# EAGLE design can-weichendecoder-servo (EAGLE 7.5.0)
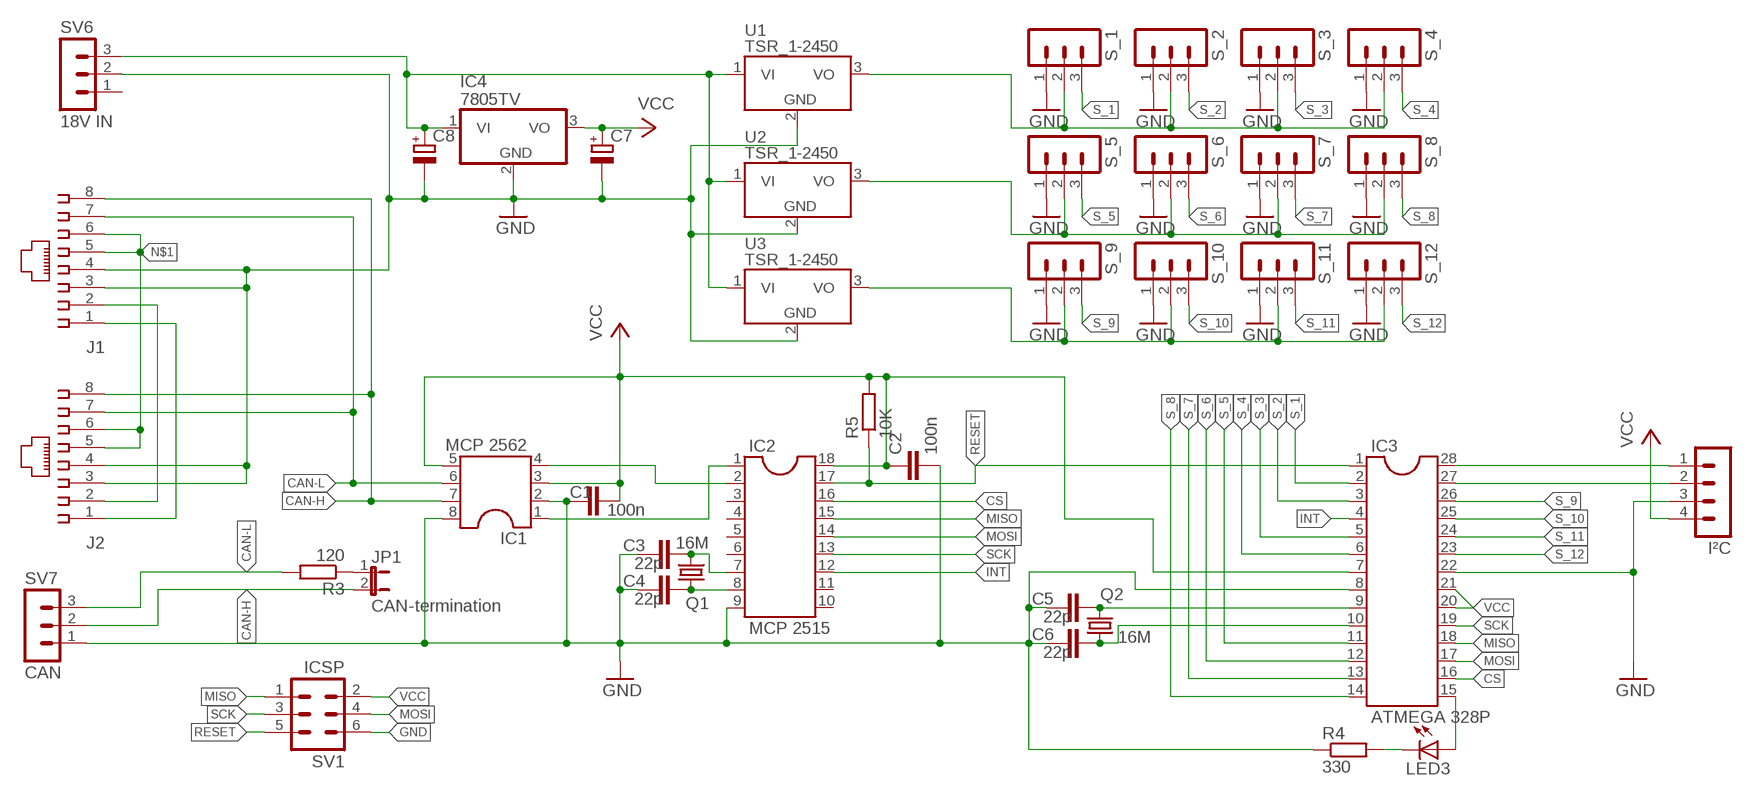
[diagram p0: schematic, sheet 1]

## Parts
C1  100n  C2.5/2  [C2.5-2]
C2  100n  C2.5/2  [C2.5-2]
C3  22p  C2.5/2  [C2.5-2]
C4  22p  C2.5/2  [C2.5-2]
C5  22p  C2.5/2  [C2.5-2]
C6  22p  C2.5/2  [C2.5-2]
C7  CPOL-EUE2.5-6  [E2,5-6]
C8  CPOL-EUE2.5-6  [E2,5-6]
IC1  MCP 2562  DIL8S  [SOCKET-08]
IC2  MCP 2515  DIL18S  [SOCKET-18]
IC3  ATMEGA 328P  DIL28-3  [DIL28-3]
IC4  7805TV  [TO220V]
I²C  MA04-1  [MA04-1]
J1  215877-7  [215877-7]
J2  215877-7  [215877-7]
JP1  CAN-termination  JP1E  [JP1]
LED3  LED5MM  [LED5MM]
Q1  16M  CRYSTALHC49S  [HC49/S]
Q2  16M  CRYSTALHC49S  [HC49/S]
R3  120  R-EU_0207/10  [0207/10]
R4  330  R-EU_0207/10  [0207/10]
R5  10K  R-EU_0207/10  [0207/10]
S_1  MA03-1  [MA03-1]
S_2  MA03-1  [MA03-1]
S_3  MA03-1  [MA03-1]
S_4  MA03-1  [MA03-1]
S_5  MA03-1  [MA03-1]
S_6  MA03-1  [MA03-1]
S_7  MA03-1  [MA03-1]
S_8  MA03-1  [MA03-1]
S_9  MA03-1  [MA03-1]
S_10  MA03-1  [MA03-1]
S_11  MA03-1  [MA03-1]
S_12  MA03-1  [MA03-1]
SV1  ICSP  MA03-2  [MA03-2]
SV6  18V IN  MA03-1  [MA03-1]
SV7  CAN  MA03-1  [MA03-1]
U1  TSR_1-2450  [TSR-1]
U2  TSR_1-2450  [TSR-1]
U3  TSR_1-2450  [TSR-1]

## Nets
CAN-H: IC1.7 J1.8 J2.8 JP1.2 SV7.2
CAN-L: IC1.6 J1.7 J2.7 R3.2 SV7.3
CS: IC2.16 IC3.16
GND: C1.1 C2.2 C3.1 C4.1 C5.1 C6.1 C7.- C8.- IC1.2 IC1.8 IC2.9 IC3.8 IC3.22 IC4.2(GND) I²C.3 J1.3 J1.4 J2.3 J2.4 R4.1 S_1.1 S_2.1 S_3.1 S_4.1 S_5.1 S_6.1 S_7.1 S_8.1 S_9.1 S_10.1 S_11.1 S_12.1 SV1.6 SV6.2 SV7.1 U1.2(GND) U2.2(GND) U3.2(GND)
INT: IC2.12 IC3.4
MISO: IC2.15 IC3.18 SV1.1
MOSI: IC2.14 IC3.17 SV1.4
N$1: J1.5 J1.6 J2.5 J2.6
N$2: IC1.4 IC2.2
N$3: J1.2 J2.2
N$4: C4.2 IC2.8 Q1.1
N$5: JP1.1 R3.1
N$6: C3.2 IC2.7 Q1.2
N$7: C5.2 IC3.9 Q2.2
N$8: C6.2 IC3.10 Q2.1
N$9: IC1.1 IC2.1
N$12: LED3.K(C) R4.2
N$13: IC3.15 LED3.A
N$24: S_1.2 S_2.2 S_3.2 S_4.2 U1.3(VO)
N$25: S_5.2 S_6.2 S_7.2 S_8.2 U2.3(VO)
N$26: S_9.2 S_10.2 S_11.2 S_12.2 U3.3(VO)
N$32: J1.1 J2.1
N$33: IC3.28 I²C.1
N$34: IC3.27 I²C.2
RESET: IC2.17 IC3.1 R5.1 SV1.5
S_1: IC3.2 S_1.3
S_2: IC3.3 S_2.3
S_3: IC3.5 S_3.3
S_4: IC3.6 S_4.3
S_5: IC3.11 S_5.3
S_6: IC3.12 S_6.3
S_7: IC3.13 S_7.3
S_8: IC3.14 S_8.3
S_9: IC3.26 S_9.3
S_10: IC3.25 S_10.3
S_11: IC3.24 S_11.3
S_12: IC3.23 S_12.3
SCK: IC2.13 IC3.19 SV1.3
VCC: C1.2 C2.1 C7.+ IC1.3 IC1.5 IC2.18 IC3.7 IC3.20 IC3.21 IC4.3(VO) I²C.4 R5.2 SV1.2
VI: C8.+ IC4.1(VI) SV6.3 U1.1(VI) U2.1(VI) U3.1(VI)
Unconnected: IC2.3 IC2.4 IC2.5 IC2.6 IC2.10 IC2.11 SV6.1

## Library data of the parts
C1-C6 = capacitor-wima:C: CAPACITOR naming: grid - package width
C7 C8 = resistor:CPOL-EU: POLARIZED CAPACITOR, European symbol
IC1 = ic-package:DIL8: Dual In Line / Socket
IC2 = ic-package:DIL18: Dual In Line / Socket
IC3 = ic-package:DIL28: Dual In Line
IC4 = linear:78*: Positive VOLTAGE REGULATOR Source: http://cache.national.com/ds/LM/LM78L05.pdf http://www.fairchildsemi.com/ds/LM/LM7805.pdf
I²C = con-lstb:MA04-1: PIN HEADER; OC_FARNELL: unknown; OC_NEWARK: unknown
J1 J2 = con-amp:215877-7: AMP connector
JP1 = jumper:JP1E: JUMPER
LED3 = led:LED: LED OSRAM: - CHIPLED LG R971, LG N971, LY N971, LG Q971, LY Q971, LO R971, LY R971 LH N974, LH R974 LS Q976, LO Q976, LY Q976 LO Q996 - Hyper CHIPLED LW Q18S LB Q993, LB Q99A, LB R99A - SideLED LS A670, LO A670, LY A670, LG A670, LP A670 LB A673, LV A673, LT A673, LW A673 LH A674 LY A675 LS A676, LA A676, LO A676, LY A676, LW A676 LS A679, LY A679, LG A679 - Hyper Micro SIDELED® LS Y876, LA Y876, LO Y876, LY Y876 LT Y87S - SmartLED LW L88C, LW L88S LB L89C, LB L89S, LG L890 LS L89K, LO L89K, LY L89K LS L896, LA L896, LO L896, LY L896 - TOPLED LS T670, LO T670, LY T670, LG T670, LP T670 LSG T670, LSP T670, LSY T670, LOP T670, LYG T670 LG T671, LOG T671, LSG T671 LB T673, LV T673, LT T673, LW T673 LH T674 LS T676, LA T676, LO T676, LY T676, LB T676, LH T676, LSB T676, LW T676 LB T67C, LV T67C, LT T67C, LS T67K, LO T67K, LY T67K, LW E67C LS E67B, LA E67B, LO E67B, LY E67B, LB E67C, LV E67C, LT E67C LW T67C LS T679, LY T679, LG T679 LS T770, LO T770, LY T770, LG T770, LP T770 LB T773, LV T773, LT T773, LW T773 LH T774 LS E675, LA E675, LY E675, LS T675 LS T776, LA T776, LO T776, LY T776, LB T776 LHGB T686 LT T68C, LB T68C - Hyper Mini TOPLED® LB M676 - Mini TOPLED Santana® LG M470 LS M47K, LO M47K, LY M47K Source: http://www.osram.convergy.de LUXEON: - LUMILED® LXK2-PW12-R00, LXK2-PW12-S00, LXK2-PW14-U00, LXK2-PW14-V00 LXK2-PM12-R00, LXK2-PM12-S00, LXK2-PM14-U00 LXK2-PE12-Q00, LXK2-PE12-R00, LXK2-PE12-S00, LXK2-PE14-T00, LXK2-PE14-U00 LXK2-PB12-K00, LXK2-PB12-L00, LXK2-PB12-M00, LXK2-PB14-N00, LXK2-PB14-P00, LXK2-PB14-Q00 LXK2-PR12-L00, LXK2-PR12-M00, LXK2-PR14-Q00, LXK2-PR14-R00 LXK2-PD12-Q00, LXK2-PD12-R00, LXK2-PD12-S00 LXK2-PH12-R00, LXK2-PH12-S00 LXK2-PL12-P00, LXK2-PL12-Q00, LXK2-PL12-R00 Source: www.luxeon.com KINGBRIGHT: KA-3528ASYC Source: www.kingbright.com
Q1 Q2 = crystal:CRYSTAL: CRYSTAL; OC_FARNELL: 1667008; OC_NEWARK: unknown
R3-R5 = rcl:R-EU_: RESISTOR, European symbol
S_1-S_12 SV6 SV7 = con-lstb:MA03-1: PIN HEADER; OC_FARNELL: unknown; OC_NEWARK: unknown
SV1 = con-lstb:MA03-2: PIN HEADER; OC_FARNELL: unknown; OC_NEWARK: unknown
U1-U3 = _traco_tsr-1:TSR_1-*: TRACO TSR-1 Series Point-of-Load DC/DC-Converters Vi max. 36 V; Vo = (1.2 .. 15)V ±2%; Io = 0 .. 1 A SIP-Package (drop-in replacement for 78xx linear voltage regulators in TO220-package, vertically assembled) Source: www.tracopower.com Technologies: TSR 1- Vi (V) Vo (V) ±2% Io = 0 .. 1 A 24_ ( generic ) 2412 4.6 .. 36 1.2 2415 4.6 .. 36 1.5 2418 4.6 .. 36 1.8 2425 4.6 .. 36 2.5 2433 4.75.. 36 3.3 2450 6.5 .. 36 5.0 2465 9.0 .. 36 6.5 2490 12 .. 36 9.0 24120 15 .. 36 12 24150 18 .. 36 15 Author: Dipl.-Ing. FH Rainer Bayer HHN Hochschule Heilbronn, rainer.bayer@hs-heilbronn.de Ingenieurbüro ing-rb, mail@ing-rb.de

## Board
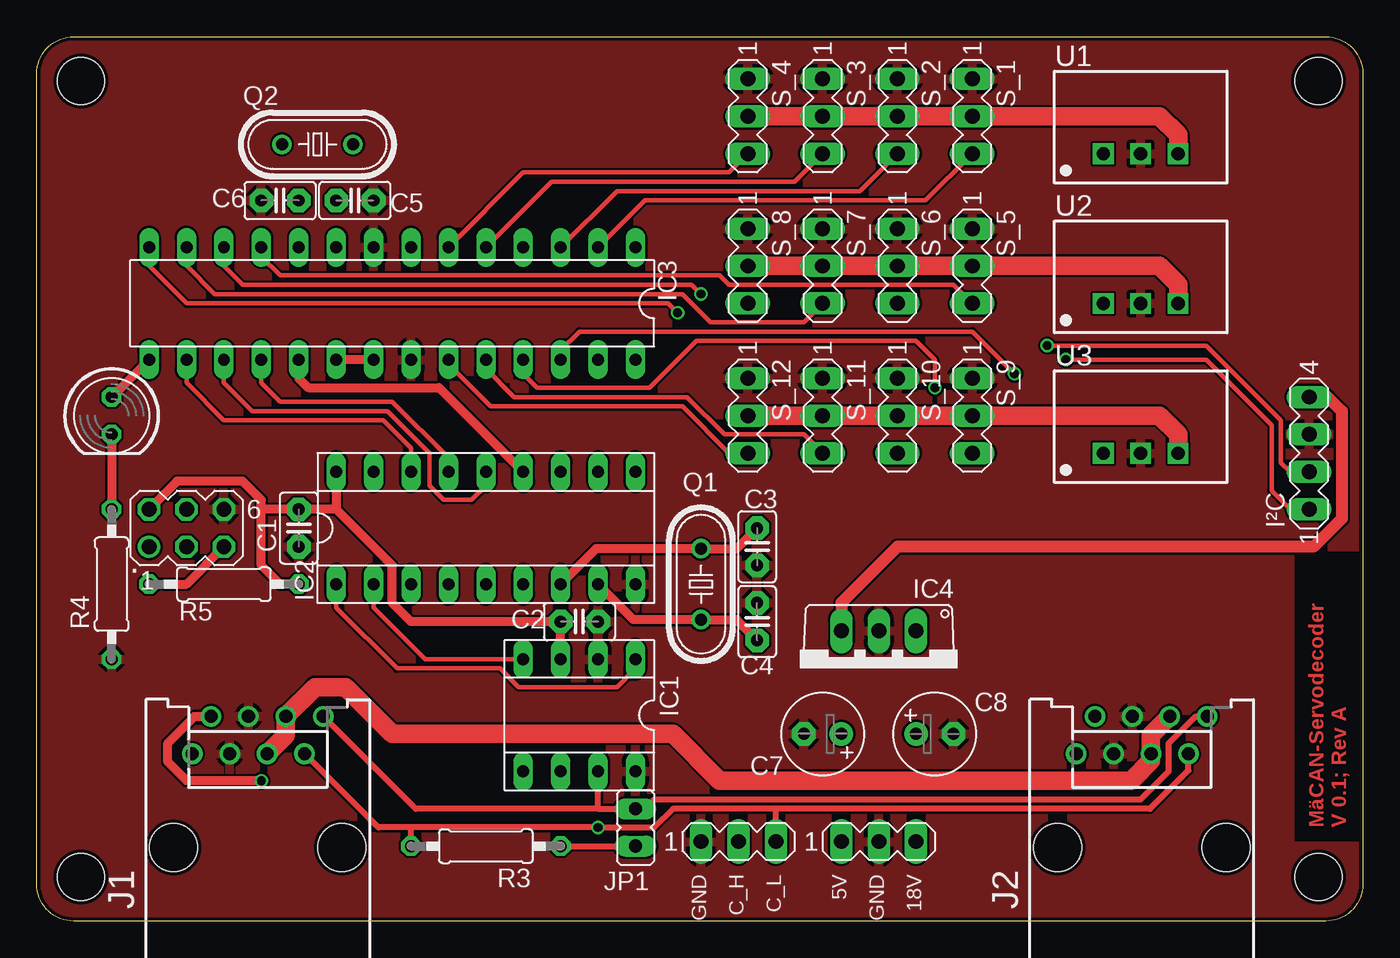
[diagram p1: board, top side]
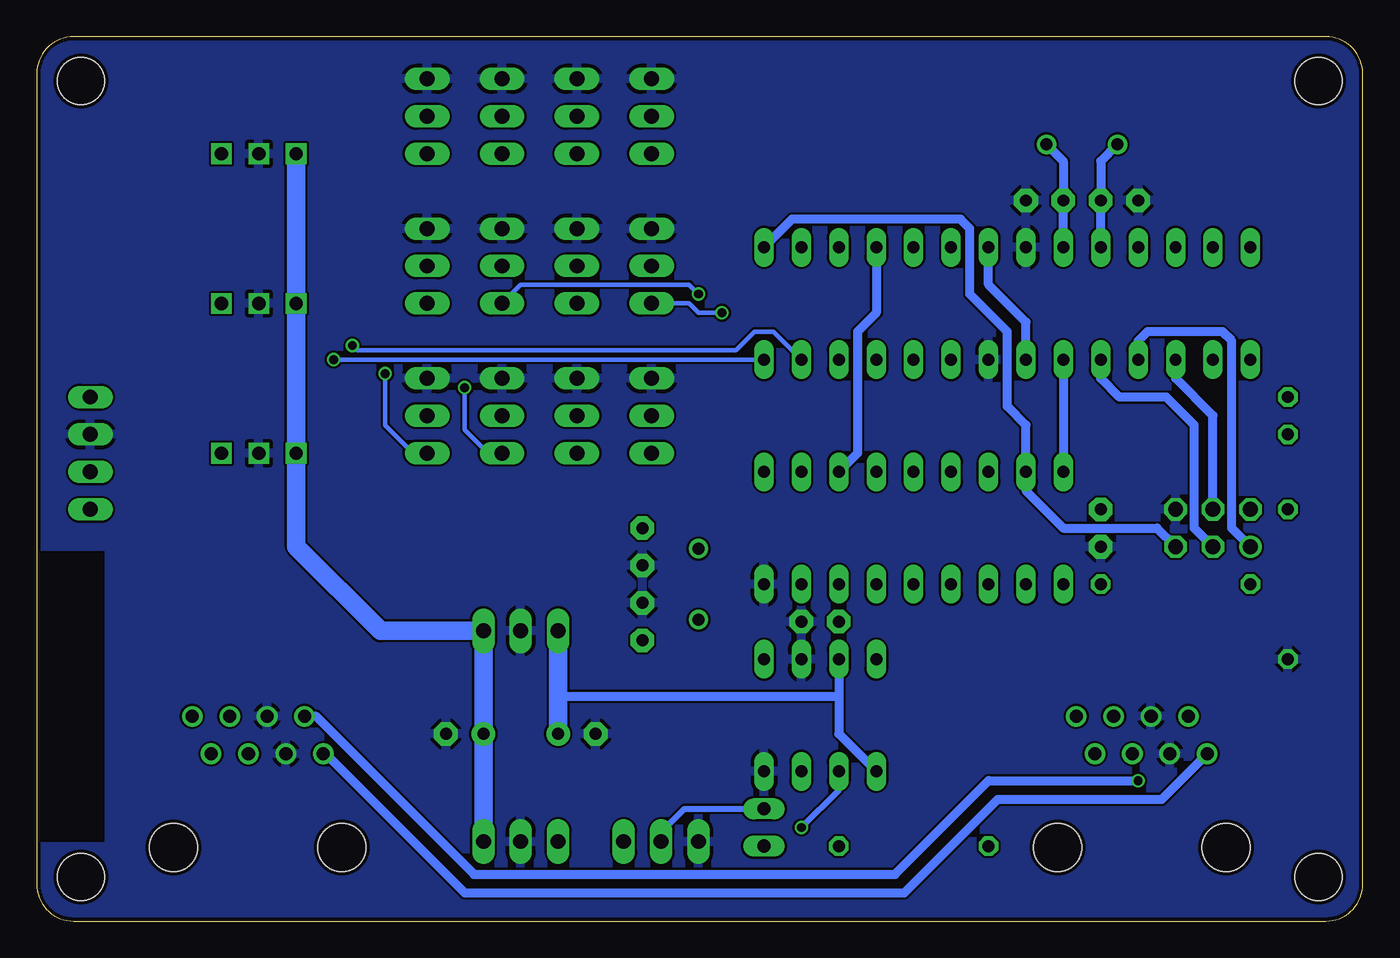
[diagram p2: board, bottom side, seen from below]

Size 90 x 60 mm. Coordinates in mm from the lower left corner, seen from the top.
Outline: 0,57.5 arc-90 2.5,60 87.5,60 arc-90 90,57.5 90,2.5 arc-90 87.5,0 2.5,0 arc-90 0,2.5 0,57.5
Copper layers (1*16): Top 0.035mm / dielectric 1.5mm / Bottom 0.035mm
Design rules "ITEADstudioDRC": minimum track width 6mil, minimum drill 12mil, track to track 6mil, track to pad 6mil, pad to pad 6mil, via to via 6mil, smd to smd 0mil, copper to edge 10mil, drill to drill 10mil, minimum pad ring 10mil, minimum via ring 6mil, stop-mask expansion 2mil, vias tented up to drill 100mil, thermal gap 10mil
Holes 3.2 mm at 3,3 87,3 87,57 3,57

### Footprints (pad centres in the part's own frame; a part is rotated, then mirrored left to right if it is on the bottom)
C2.5-2 = drill 0.813 pad 1.6 octagon: 1 -1.27,0; 2 1.27,0
E2,5-6 = drill 0.813 pad 1.6: + -1.27,0 | drill 0.813 pad 1.6 octagon: - 1.27,0
SOCKET-08 = drill 0.813 long: 1 -3.81,-3.81; 2 -1.27,-3.81; 3 1.27,-3.81; 4 3.81,-3.81; 5 3.81,3.81; 6 1.27,3.81; 7 -1.27,3.81; 8 -3.81,3.81
SOCKET-18 = drill 0.813 long: 1 -10.16,-3.81; 2 -7.62,-3.81; 3 -5.08,-3.81; 4 -2.54,-3.81; 5 0,-3.81; 6 2.54,-3.81; 7 5.08,-3.81; 8 7.62,-3.81; 9 10.16,-3.81; 10 10.16,3.81; 11 7.62,3.81; 12 5.08,3.81; 13 2.54,3.81; 14 0,3.81; 15 -2.54,3.81; 16 -5.08,3.81; 17 -7.62,3.81; 18 -10.16,3.81
DIL28-3 = drill 0.813 long: 1 -16.51,-3.81; 2 -13.97,-3.81; 3 -11.43,-3.81; 4 -8.89,-3.81; 5 -6.35,-3.81; 6 -3.81,-3.81; 7 -1.27,-3.81; 8 1.27,-3.81; 9 3.81,-3.81; 10 6.35,-3.81; 11 8.89,-3.81; 12 11.43,-3.81; 13 13.97,-3.81; 14 16.51,-3.81; 15 16.51,3.81; 16 13.97,3.81; 17 11.43,3.81; 18 8.89,3.81; 19 6.35,3.81; 20 3.81,3.81; 21 1.27,3.81; 22 -1.27,3.81; 23 -3.81,3.81; 24 -6.35,3.81; 25 -8.89,3.81; 26 -11.43,3.81; 27 -13.97,3.81; 28 -16.51,3.81
TO220V = drill 1.016 long: 1 -2.54,-2.54; 2 0,-2.54; 3 2.54,-2.54
MA04-1 = drill 1.016 long: 1 -3.81,0; 2 -1.27,0; 3 1.27,0; 4 3.81,0
215877-7 = drill 0.889: 1 -4.445,6.35; 2 -3.175,8.89; 3 -1.905,6.35; 4 -0.635,8.89; 5 0.635,6.35; 6 1.905,8.89; 7 3.175,6.35; 8 4.445,8.89 | hole 3.251: -5.715,0; 5.715,0
JP1 = drill 0.914 long: 1 0,-1.27; 2 0,1.27
LED5MM = drill 0.813 octagon: A -1.27,0; K 1.27,0
HC49/S = drill 0.813: 1 -2.413,0; 2 2.413,0
0207/10 = drill 0.813 octagon: 1 -5.08,0; 2 5.08,0
MA03-1 = drill 1.016 long: 1 -2.54,0; 2 0,0; 3 2.54,0
MA03-2 = drill 1.016: 1 -2.54,-1.27 | drill 1.016 octagon: 2 -2.54,1.27; 3 0,-1.27; 4 0,1.27; 5 2.54,-1.27; 6 2.54,1.27
TSR-1 = drill 0.9 square: 1 -2.54,0; 2 0,0; 3 2.54,0

### Placement (x,y rotation side)
C1  17.78,26.67 90 top
C2  36.83,20.32 0 top
C3  48.9,25.4 90 top
C4  48.9,20.32 270 top
C5  21.59,48.9 180 top
C6  16.51,48.9 0 top
C7  53.34,12.7 180 top
C8  60.96,12.7 0 top
IC1  36.83,13.97 180 top
IC2  30.48,26.67 0 top
IC3  24.13,41.91 180 top
IC4  57.15,17.14 180 top
I²C  86.36,31.75 90 top
J1  15,5 0 top
J2  75,5 0 top
JP1  40.64,6.35 0 top
LED3  5.08,34.29 270 top
Q1  45.09,22.86 90 top
Q2  19.05,52.7 0 top
R3  30.48,5.08 180 top
R4  5.08,22.86 90 top
R5  12.7,22.86 0 top
S_1  63.5,54.61 270 top
S_2  58.42,54.61 270 top
S_3  53.34,54.61 270 top
S_4  48.26,54.61 270 top
S_5  63.5,44.45 270 top
S_6  58.42,44.45 270 top
S_7  53.34,44.45 270 top
S_8  48.26,44.45 270 top
S_9  63.5,34.29 270 top
S_10  58.42,34.29 270 top
S_11  53.34,34.29 270 top
S_12  48.26,34.29 270 top
SV1  10.16,26.67 0 top
SV6  57.15,5.4 0 top
SV7  47.62,5.4 0 top
U1  74.93,52.07 0 top
U2  74.93,41.91 0 top
U3  74.93,31.75 0 top

### Tracks (layer width: path | path; a pad name or v marks a point on that pad's centre or on a via)
CAN-H
  Top 0.406: 38.1,7.62 IC1.7 | 38.1,7.62 JP1.2 41.27,7.62 41.91,8.26 74.93,8.26 76.83,10.16 76.83,12.06 78.66,13.89 J2.8 | 38.1,7.62 25.71,7.62 J1.8
  Bottom 0.406: SV7.2 47.62,6.03 46.04,7.62 JP1.2
CAN-L  (via drill 0.6)
  Top 0.406: 50.16,7.62 75.56,7.62 78.17,10.23 J2.7 | 50.16,7.62 43.18,7.62 41.91,6.35 v38.1,6.35 25.4,6.35 | SV7.3 50.16,7.62 | 25.4,6.35 23.18,6.35 J1.7 | R3.2 25.4,6.35
  Bottom 0.406: IC1.6 35.56,8.89 v38.1,6.35
CS
  Top 0.305: IC3.16 10.16,36.51 12.7,33.97 23.5,33.97 25.4,32.07 IC2.16
GND
  pour Top: -1.27,-1.27 91.44,-1.27 91.44,5.08 85.09,5.08 85.09,25.4 91.44,25.4 91.44,60.96 -1.27,60.96
  pour Bottom: -1.27,-1.27 91.44,-1.27 91.44,5.08 85.09,5.08 85.09,25.4 91.44,25.4 91.44,60.96 -1.27,60.96
INT
  Bottom 0.61: IC3.4 33.02,41.27 34.29,40.01 34.29,31.75 IC2.12
MISO
  Top 0.305: IC2.15 27.94,31.43 24.13,35.24 16.51,35.24 15.24,36.51 IC3.18
  Bottom 0.61: SV1.1 8.89,26.67 8.89,39.37 9.53,40.01 14.61,40.01 15.24,39.37 IC3.18
MOSI
  Top 0.305: IC2.14 30.48,29.53 29.53,28.57 27.62,28.57 26.67,29.53 26.67,31.75 23.81,34.61 14.61,34.61 12.7,36.51 IC3.17
  Bottom 0.61: SV1.4 10.16,34.29 12.7,36.83 IC3.17
N$1
  Top 1.27: J1.5 16.91,12.62 J1.6 18.89,15.88 20.95,15.88 24.13,12.7 43.18,12.7 46.35,9.53 74.3,9.53 75.64,10.87 J2.5 75.64,12.62 J2.6
N$2
  Top 0.305: IC1.4 26.35,17.78 22.86,21.27 IC2.2
N$3  (via drill 0.6)
  Top 0.61: v15.24,9.53 10.16,9.53 8.89,10.79 8.89,12.06 10.71,13.89 J1.2
  Bottom 0.61: v15.24,9.53 25.4,9.53 31.75,3.17 60.33,3.17 71.04,13.89 J2.2
N$4
  Top 0.61: IC2.8 40.51,20.45 Q1.1 47.5,20.45 C4.2
N$5
  Top 0.406: R3.1 JP1.1
N$6
  Top 0.61: IC2.7 37.97,25.27 Q1.2 47.5,25.27 C3.2
N$7
  Bottom 0.61: IC3.9 C5.2 20.32,51.56 Q2.2
N$8
  Bottom 0.61: IC3.10 C6.2 17.78,51.56 Q2.1
N$9
  Top 0.305: IC1.1 40.64,17.14 39.37,15.88 32.7,15.88 31.43,17.14 24.45,17.14 20.32,21.27 IC2.1
N$12
  Top 0.61: LED3.K R4.2
N$13
  Top 0.61: IC3.15 LED3.A
N$24
  Top 1.27: U1.3 77.47,53.34 76.2,54.61 S_1.2 S_2.2 S_3.2 S_4.2
N$25
  Top 1.27: U2.3 77.47,43.18 76.2,44.45 S_5.2 S_6.2 S_7.2 S_8.2
N$26
  Top 1.27: U3.3 77.47,33.02 76.2,34.29 S_9.2 S_10.2 S_11.2 S_12.2
N$32
  Bottom 0.61: J1.1 13.65,8.26 24.77,8.26 31.11,1.91 60.96,1.91 70.41,11.35 J2.1
N$33  (via drill 0.6)
  Top 0.305: v69.85,38.1 79.38,38.1 83.82,33.66 83.82,29.21 85.09,27.94 I²C.1
  Bottom 0.305: IC3.28 v69.85,38.1
N$34  (via drill 0.6)
  Top 0.305: I²C.2 85.09,30.48 84.45,31.11 84.45,33.97 79.38,39.05 v68.58,39.05
  Bottom 0.305: IC3.27 40.01,40.01 41.27,40.01 42.55,38.73 68.26,38.73 v68.58,39.05
RESET
  Top 0.61: R5.1 10.16,22.86 SV1.5
  Bottom 0.61: SV1.5 13.97,26.67 20.32,26.67 22.86,29.21 IC2.17 22.86,33.66 24.13,34.92 24.13,40.01 26.67,42.55 26.67,46.99 27.3,47.62 38.73,47.62 IC3.1
S_1
  Top 0.305: IC3.2 41.27,48.9 60.33,48.9 S_1.3
S_2
  Top 0.305: IC3.3 39.37,49.53 55.88,49.53 S_2.3
S_3
  Top 0.305: IC3.5 34.92,50.16 51.44,50.16 S_3.3
S_4
  Top 0.305: IC3.6 33.02,50.8 46.99,50.8 S_4.3
S_5
  Top 0.305: IC3.11 15.24,45.09 16.51,43.81 46.35,43.81 46.99,43.18 62.23,43.18 S_5.3
S_6  (via drill 0.6)
  Top 0.305: IC3.12 12.7,44.45 13.97,43.18 44.45,43.18 v45.09,42.55
  Bottom 0.305: v45.09,42.55 45.72,43.18 57.15,43.18 S_6.3
S_7
  Top 0.305: IC3.13 10.16,44.45 12.06,42.55 43.81,42.55 45.72,40.64 52.07,40.64 S_7.3
S_8  (via drill 0.6)
  Top 0.305: IC3.14 7.62,44.45 10.16,41.91 42.86,41.91 v43.5,41.27
  Bottom 0.305: v43.5,41.27 45.09,41.27 45.72,41.91 S_8.3
S_9  (via drill 0.6)
  Top 0.305: IC3.26 35.56,38.73 36.83,40.01 63.5,40.01 v66.36,37.15
  Bottom 0.305: v66.36,37.15 66.36,33.66 64.45,31.75 S_9.3
S_10  (via drill 0.6)
  Top 0.305: IC3.25 33.02,37.15 33.97,36.2 41.59,36.2 44.77,39.37 59.69,39.37 60.96,38.1 v60.96,36.2
  Bottom 0.305: v60.96,36.2 60.96,33.34 59.37,31.75 S_10.3
S_11
  Top 0.305: IC3.24 30.48,37.47 32.38,35.56 44.13,35.56 46.67,33.02 52.07,33.02 S_11.3
S_12
  Top 0.305: IC3.23 27.94,37.78 30.8,34.92 43.81,34.92 46.99,31.75 S_12.3
SCK
  Top 0.61: IC3.19 17.78,36.83 18.41,36.2 27.3,36.2 IC2.13
  Bottom 0.61: SV1.3 11.43,26.67 11.43,33.66 13.34,35.56 16.51,35.56 17.78,36.83 IC3.19
VCC
  Top 0.61: IC1.3 C2.1 25.4,20.32 24.13,21.59 24.13,24.13 20.32,27.94 | 20.32,27.94 C1.2 15.24,27.94 | IC2.18 20.32,27.94 | IC3.20 IC3.21 22.86,37.47 | R5.2 16.51,22.86 15.24,24.13 15.24,27.94 | 15.24,27.94 15.24,28.57 13.97,29.84 9.53,29.84 SV1.2
  Top 0.813: I²C.4 87.63,35.56 88.58,34.61 88.58,27.3 86.68,25.4 58.42,25.4 54.61,21.59 IC4.3
  Bottom 0.61: IC1.3 35.56,15.24 | 35.56,15.24 35.56,12.7 IC1.5 | IC3.20 IC2.18 | 54.61,15.24 35.56,15.24 | IC3.21 22.86,40.64 25.4,43.18 IC3.7
  Bottom 1.27: IC4.3 54.61,15.24 C7.+
VI
  Bottom 1.27: U1.1 U2.1 U3.1 72.39,25.4 66.67,19.68 IC4.1 C8.+ SV6.3

### Text on the board
Top: MäCAN-Servodecoder / V 0.1; Rev A
tPlace: . | GND | 18V
tNames: GND | C_H | C_L | 5V